# Altium project FMC_SDR_LFFE.PrjPcb (part 2 of 3)

## Sheet LTM8056.SchDoc
size A3; DocumentNumber: 9; SheetNumber: 9; SheetTotal: 10
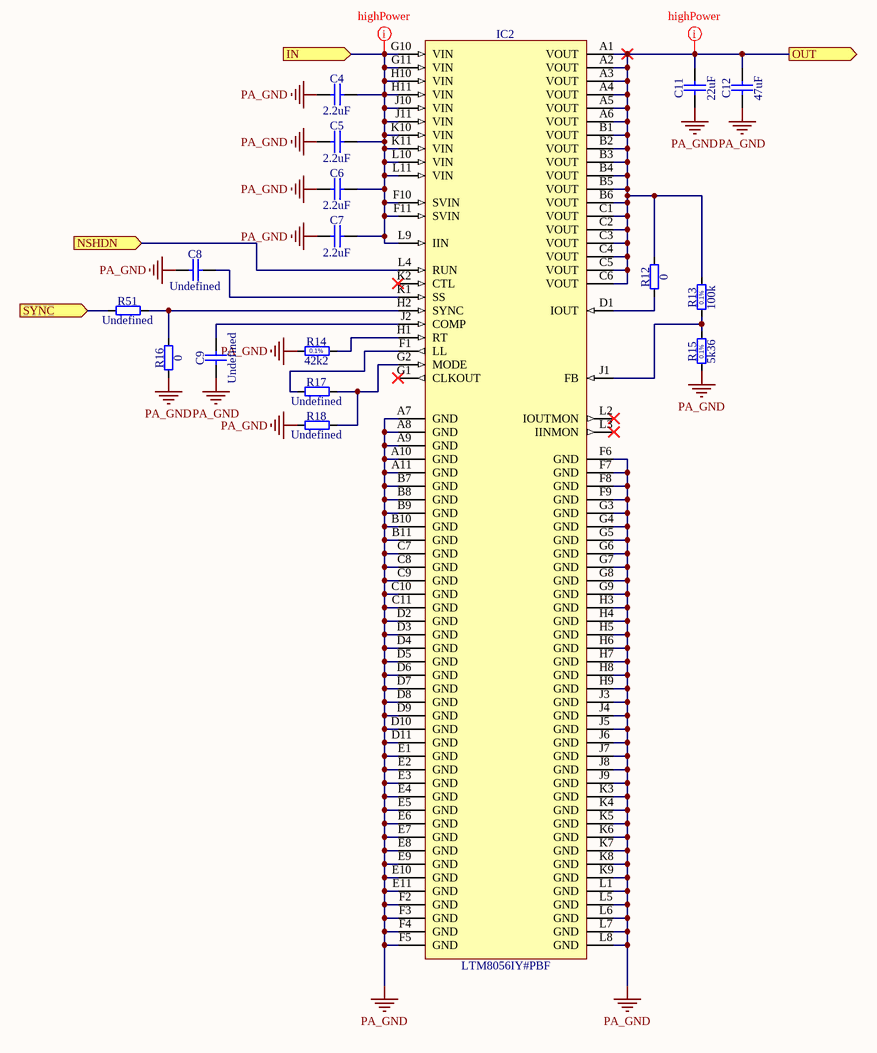
[diagram p4: LTM8056.SchDoc]

### Parts
C4  2.2uF  [CAPC3216X180N]
C5  2.2uF  [CAPC3216X180N]
C6  2.2uF  [CAPC3216X180N]
C7  2.2uF  [CAPC3216X180N]
C8  Undefined  [CAPC1608X90N]
C9  Undefined  [CAPC1608X90N]
C11  22uF  [CAPC_KEMET_KPS2220]
C12  47uF  [CAPC_TDK_CKG57N]
IC2  LTM8056IY#PBF  [BGA121C127P11X11_1500X1500X512]
R12  0  [RESC1608X55N]
R13  100k  [RESC1608X55N]
R14  42k2  [RESC1608X55N]
R15  5k36  [RESC1608X55N]
R16  0  [RESC1608X55N]
R17  Undefined  [RESC1608X55N]
R18  Undefined  [RESC1608X55N]
R51  Undefined  [RESC1608X55N]

### Ports
IN (in), NSHDN (in), OUT (out), SYNC (in)

### Nets
FE_PA_VDD: C11.2 C12.2 IC2.A1(VOUT) IC2.A2(VOUT) IC2.A3(VOUT) IC2.A4(VOUT) IC2.A5(VOUT) IC2.A6(VOUT) IC2.B1(VOUT) IC2.B2(VOUT) IC2.B3(VOUT) IC2.B4(VOUT) IC2.B5(VOUT) IC2.B6(VOUT) IC2.C1(VOUT) IC2.C2(VOUT) IC2.C3(VOUT) IC2.C4(VOUT) IC2.C5(VOUT) IC2.C6(VOUT) R12.2 R13.2 ; port OUT
PA_GND: C4.1 C5.1 C6.1 C7.1 C8.1 C9.1 C11.1 C12.1 IC2.A7(GND) IC2.A8(GND) IC2.A9(GND) IC2.A10(GND) IC2.A11(GND) IC2.B7(GND) IC2.B8(GND) IC2.B9(GND) IC2.B10(GND) IC2.B11(GND) IC2.C7(GND) IC2.C8(GND) IC2.C9(GND) IC2.C10(GND) IC2.C11(GND) IC2.D2(GND) IC2.D3(GND) IC2.D4(GND) IC2.D5(GND) IC2.D6(GND) IC2.D7(GND) IC2.D8(GND) IC2.D9(GND) IC2.D10(GND) IC2.D11(GND) IC2.E1(GND) IC2.E2(GND) IC2.E3(GND) IC2.E4(GND) IC2.E5(GND) IC2.E6(GND) IC2.E7(GND) IC2.E8(GND) IC2.E9(GND) IC2.E10(GND) IC2.E11(GND) IC2.F2(GND) IC2.F3(GND) IC2.F4(GND) IC2.F5(GND) IC2.F6(GND) IC2.F7(GND) IC2.F8(GND) IC2.F9(GND) IC2.G3(GND) IC2.G4(GND) IC2.G5(GND) IC2.G6(GND) IC2.G7(GND) IC2.G8(GND) IC2.G9(GND) IC2.H3(GND) IC2.H4(GND) IC2.H5(GND) IC2.H6(GND) IC2.H7(GND) IC2.H8(GND) IC2.H9(GND) IC2.J3(GND) IC2.J4(GND) IC2.J5(GND) IC2.J6(GND) IC2.J7(GND) IC2.J8(GND) IC2.J9(GND) IC2.K3(GND) IC2.K4(GND) IC2.K5(GND) IC2.K6(GND) IC2.K7(GND) IC2.K8(GND) IC2.K9(GND) IC2.L1(GND) IC2.L5(GND) IC2.L6(GND) IC2.L7(GND) IC2.L8(GND) R14.1 R15.1 R16.1 R18.1
PA_PS_IN: C4.2 C5.2 C6.2 C7.2 IC2.F10(SVIN) IC2.F11(SVIN) IC2.G10(VIN) IC2.G11(VIN) IC2.H10(VIN) IC2.H11(VIN) IC2.J10(VIN) IC2.J11(VIN) IC2.K10(VIN) IC2.K11(VIN) IC2.L9(IIN) IC2.L10(VIN) IC2.L11(VIN) ; port IN
SYNC_DCDC: R51.1 ; port SYNC
NetC8_2: C8.2 IC2.K1(SS)
NetC9_2: C9.2 IC2.J2(COMP)
NetIC2_D1: IC2.D1(IOUT) R12.1
NetIC2_F1: IC2.F1(LL) R17.1
NetIC2_G2: IC2.G2(MODE) R17.2 R18.2
NetIC2_H1: IC2.H1(RT) R14.2
NetIC2_H2: IC2.H2(SYNC) R16.2 R51.2
NetIC2_J1: IC2.J1(FB) R13.1 R15.2
NetIC2_L4: IC2.L4(RUN) ; port NSHDN

Not connected (* = marked no-connect by the designer): IC2 G1(CLKOUT)* K2(CTL)* L2(IOUTMON)* L3(IINMON)*

### Layout directives
net class highPower: FE_PA_VDD, PA_PS_IN

### Notes on the sheet
- (in symbol R0603_5K36_0.1%_0.063W_10PPM) 0.1%
- (in symbol R0603_42K2_0.1%_0.063W_10PPM) 0.1%
- (in symbol R0603_100K_0.1%_0.063W_10PPM) 0.1%

### Library data of the parts
C4-C7 = CC1206_2.2UF_50V_10%_X7R: Non-polarised capacitor; Part Description: SMD Multilayer Chip Ceramic Capacitor; Manufacturer: GENERIC; Manufacturer1 Part Number: C1206C225K5RACTU; Voltage: 50V; TC: X7R; Tolerance: ±10%; Part Number: CC1206_2.2UF_50V_10%_X7R; Component Kind: Standard; Component Type: Standard; Pin Count: 2; Value: 2.2uF; Status: Preferred; Manufacturer Part Number: CC1206_2.2uF_50V_10%_X7R; Case: 1206; Mounted: Yes; Socket: No; SMD: Yes; Sense: No; Manufacturer1 Example: KEMET; Manufacturer1 ComponentHeight: 1.8mm; HelpURL: \\cern.ch\dfs\Applications\Altium\Datasheets\CC1206_X7R_KEMET.pdf; Author: CERN DEM MR; CreateDate: 06.06.2016; LatestRevisionDate: 06.06.2016
C8 C9 = CC0603_NO-VALUE: Non-polarised capacitor; Part Description: Reserved Footprint For 0603(1608) Chip Ceramic Capacitor; Mounted: No; Part Number: CC0603_NO-VALUE; Component Kind: Standard; Component Type: Standard; Pin Count: 2; Value: Undefined; Status: None; Manufacturer: Undefined; Manufacturer Part Number: CC0603_NO-VALUE; Case: 0603; Socket: No; SMD: Yes; Sense: No; Manufacturer1 ComponentHeight: 0.9mm; HelpURL: Undefined; Author: CERN DEM MR; CreateDate: 22.11.2016; LatestRevisionDate: 22.11.2016
C11 = CC2220_22UF_50V_20%_X7R_KEMET_KPS: Non-polarised capacitor; Part Description: Multilayer Ceramic Chip Capacitors - Stacked Cap - KEMET KPS Series; Manufacturer: KEMET; Manufacturer Part Number: C2220C226M5R2C7186; Voltage: 50V; TC: X7R; Tolerance: ±20%; Part Number: CC2220_22UF_50V_20%_X7R_KEMET_KPS; Component Kind: Standard; Component Type: Standard; Pin Count: 2; Value: 22uF; Status: None; Case: 2220; Mounted: Yes; Socket: No; SMD: Yes; Sense: No; ComponentHeight: 5.5mm; HelpURL: \\cern.ch\dfs\Applications\Altium\Datasheets\CC2220_X7R_KEMET_KPS.pdf; Author: CERN DEM JLC; CreateDate: 20.02.2018; LatestRevisionDate: 20.02.2018
C12 = CC2220_47UF_25V_20%_X7S_TDK_CKG57N: Non-polarised capacitor; Part Description: Multilayer Ceramic Chip Capacitor - Stacked Cap, CKG57N Series; Manufacturer: TDK; Manufacturer Part Number: CKG57NX7S1E476M500JH; Voltage: 25V; TC: X7S; Tolerance: ±20%; Part Number: CC2220_47UF_25V_20%_X7S_TDK_CKG57N; Component Kind: Standard; Component Type: Standard; Pin Count: 2; Value: 47uF; Status: None; Case: 2220; Mounted: Yes; Socket: No; SMD: Yes; Sense: No; ComponentHeight: 5.5mm; HelpURL: \\cern.ch\dfs\Applications\Altium\Datasheets\CC2220_X7S_TDK_CKG.pdf; Author: CERN DEM JLC; CreateDate: 21.10.2014; LatestRevisionDate: 18.12.2017
IC2 = LTM8056IY#PBF: 58VIN, 48VOUT Buck-Boost µModule Regulator; Manufacturer: LINEAR TECHNOLOGY; PressFit: No; Bonding: No; Part Number: LTM8056IY#PBF; Component Kind: Standard; Component Type: Standard; Device: LTM8056IY#PBF; PackageDescription: BGA,1.27mm Pitch, Square;121 Pin, 11 Columns X 11 Rows, 15.00mm X 15.00mm X 5.12mm H; Part Description: 58VIN, 48VOUT Buck-Boost µModule Regulator; Manufacturer Part Number: LTM8056IY#PBF; Pin Count: 121; Case: BGA121; Mounted: Yes; Socket: No; SMD: Yes; Sense: No; ComponentHeight: 5.12mm; HelpURL: \\cern.ch\dfs\Applications\Altium\Datasheets\LTM8056IY#PBF.pdf; Author: CERN DEM JLC; CreateDate: 08.04.2019; LatestRevisionDate: 08.04.2019
R12 R16 = R0603_0R_JUMPER: Resistor; Part Description: 1A (0.05R Max DC Resistance) Zero Ohm Jumper; Manufacturer: GENERIC; Manufacturer1 Part Number: NRC06Z0; PressFit: No; Part Number: R0603_0R_JUMPER; Component Kind: Standard; Component Type: Standard; Pin Count: 2; Value: 0; Status: Preferred; Manufacturer Part Number: R0603_0R_JUMPER; Case: 0603; Mounted: Yes; Sense: No; Socket: No; SMD: Yes; Manufacturer1 Example: NIC COMPONENT; Manufacturer1 ComponentHeight: 0.55mm; HelpURL: \\cern.ch\dfs\Applications\Altium\Datasheets\R0603_NIC_NRC.pdf; Author: CERN DEM JLC; CreateDate: 03.12.2007; LatestRevisionDate: 13.03.2008
R13 = R0603_100K_0.1%_0.063W_10PPM: Resistor - 0.1%; Part Description: Thin Film Chip Resistor; Manufacturer: GENERIC; Manufacturer1 Part Number: RN73C1J100KBTDF; Power: 0.063W; TC: ±10ppm; PressFit: No; Part Number: R0603_100K_0.1%_0.063W_10PPM; Component Kind: Standard; Component Type: Standard; Pin Count: 2; Value: 100k; Status: Not Recommended; Tolerance: ±0.1%; Manufacturer Part Number: R0603_100K_0.1%_0.063W_10PPM; Case: 0603; Mounted: Yes; Sense: No; Socket: No; SMD: Yes; Manufacturer1 Example: TYCO HOLSWORTHY; Manufacturer1 ComponentHeight: 0.55mm; HelpURL: \\cern.ch\dfs\Applications\Altium\Datasheets\R0603_Tyco_RN73.pdf; Author: CERN DEM JLC; CreateDate: 03.12.2007; LatestRevisionDate: 13.03.2008
R14 = R0603_42K2_0.1%_0.063W_10PPM: Resistor - 0.1%; Part Description: Thin Film Chip Resistor; Manufacturer: GENERIC; Manufacturer1 Part Number: RN73C1J42K2BTDF; Power: 0.063W; TC: ±10ppm; PressFit: No; Part Number: R0603_42K2_0.1%_0.063W_10PPM; Component Kind: Standard; Component Type: Standard; Pin Count: 2; Value: 42k2; Status: Not Recommended; Tolerance: ±0.1%; Manufacturer Part Number: R0603_42K2_0.1%_0.063W_10PPM; Case: 0603; Mounted: Yes; Sense: No; Socket: No; SMD: Yes; Manufacturer1 Example: TYCO HOLSWORTHY; Manufacturer1 ComponentHeight: 0.5mm; HelpURL: \\cern.ch\dfs\Applications\Altium\Datasheets\R0603_Tyco_RN73.pdf; Author: CERN DEM JLC; CreateDate: 03.12.2007; LatestRevisionDate: 13.03.2008
R15 = R0603_5K36_0.1%_0.063W_10PPM: Resistor - 0.1%; Part Description: Thin Film Chip Resistor; Manufacturer: GENERIC; Manufacturer1 Part Number: RN73C1J5K36BTDF; Power: 0.063W; TC: ±10ppm; PressFit: No; Part Number: R0603_5K36_0.1%_0.063W_10PPM; Component Kind: Standard; Component Type: Standard; Pin Count: 2; Value: 5k36; Status: Not Recommended; Tolerance: ±0.1%; Manufacturer Part Number: R0603_5K36_0.1%_0.063W_10PPM; Case: 0603; Mounted: Yes; Sense: No; Socket: No; SMD: Yes; Manufacturer1 Example: TYCO HOLSWORTHY; Manufacturer1 ComponentHeight: 0.5mm; HelpURL: \\cern.ch\dfs\Applications\Altium\Datasheets\R0603_Tyco_RN73.pdf; Author: CERN DEM JLC; CreateDate: 03.12.2007; LatestRevisionDate: 13.03.2008
R17 R18 R51 = R0603_NO-VALUE: Resistor; Part Description: Reserved Footprint For a 0603 (1608) Chip Resistor; PressFit: No; Mounted: No; Part Number: R0603_NO-VALUE; Component Kind: Standard; Component Type: Standard; Pin Count: 2; Value: Undefined; Status: None; Manufacturer: Undefined; Manufacturer Part Number: R0603_NO-VALUE; Case: 0603; Sense: No; Socket: No; SMD: Yes; Manufacturer1 Example: Undefined; Manufacturer1 Part Number: Undefined; Manufacturer1 ComponentHeight: Undefined; HelpURL: Undefined; Author: CERN DEM JLC; CreateDate: 03.12.2007; LatestRevisionDate: 13.03.2008

## Sheet QPL9065.SchDoc: Title
size 420 x 297 mm; CheckedBy: -; CompanyName: CERN; DrawnBy: DrawnBy; Organization: CERN; Address1: European Organization for Nuclear Research; Address2: CH-1211 Genčve 23 - Switzerland; DocumentNumber: 4; Revision: -; SheetNumber: 4; SheetTotal: 10; EDA_Number: EDA-XXXXX-VX-X; Projet: -; ModifiedBy: -; CreateDate: XX/XX/XXXX; CheckedDate: -; Title2: Title2; DivGrp: TE/MPE; Designer: Designer; ModifiedDate: -
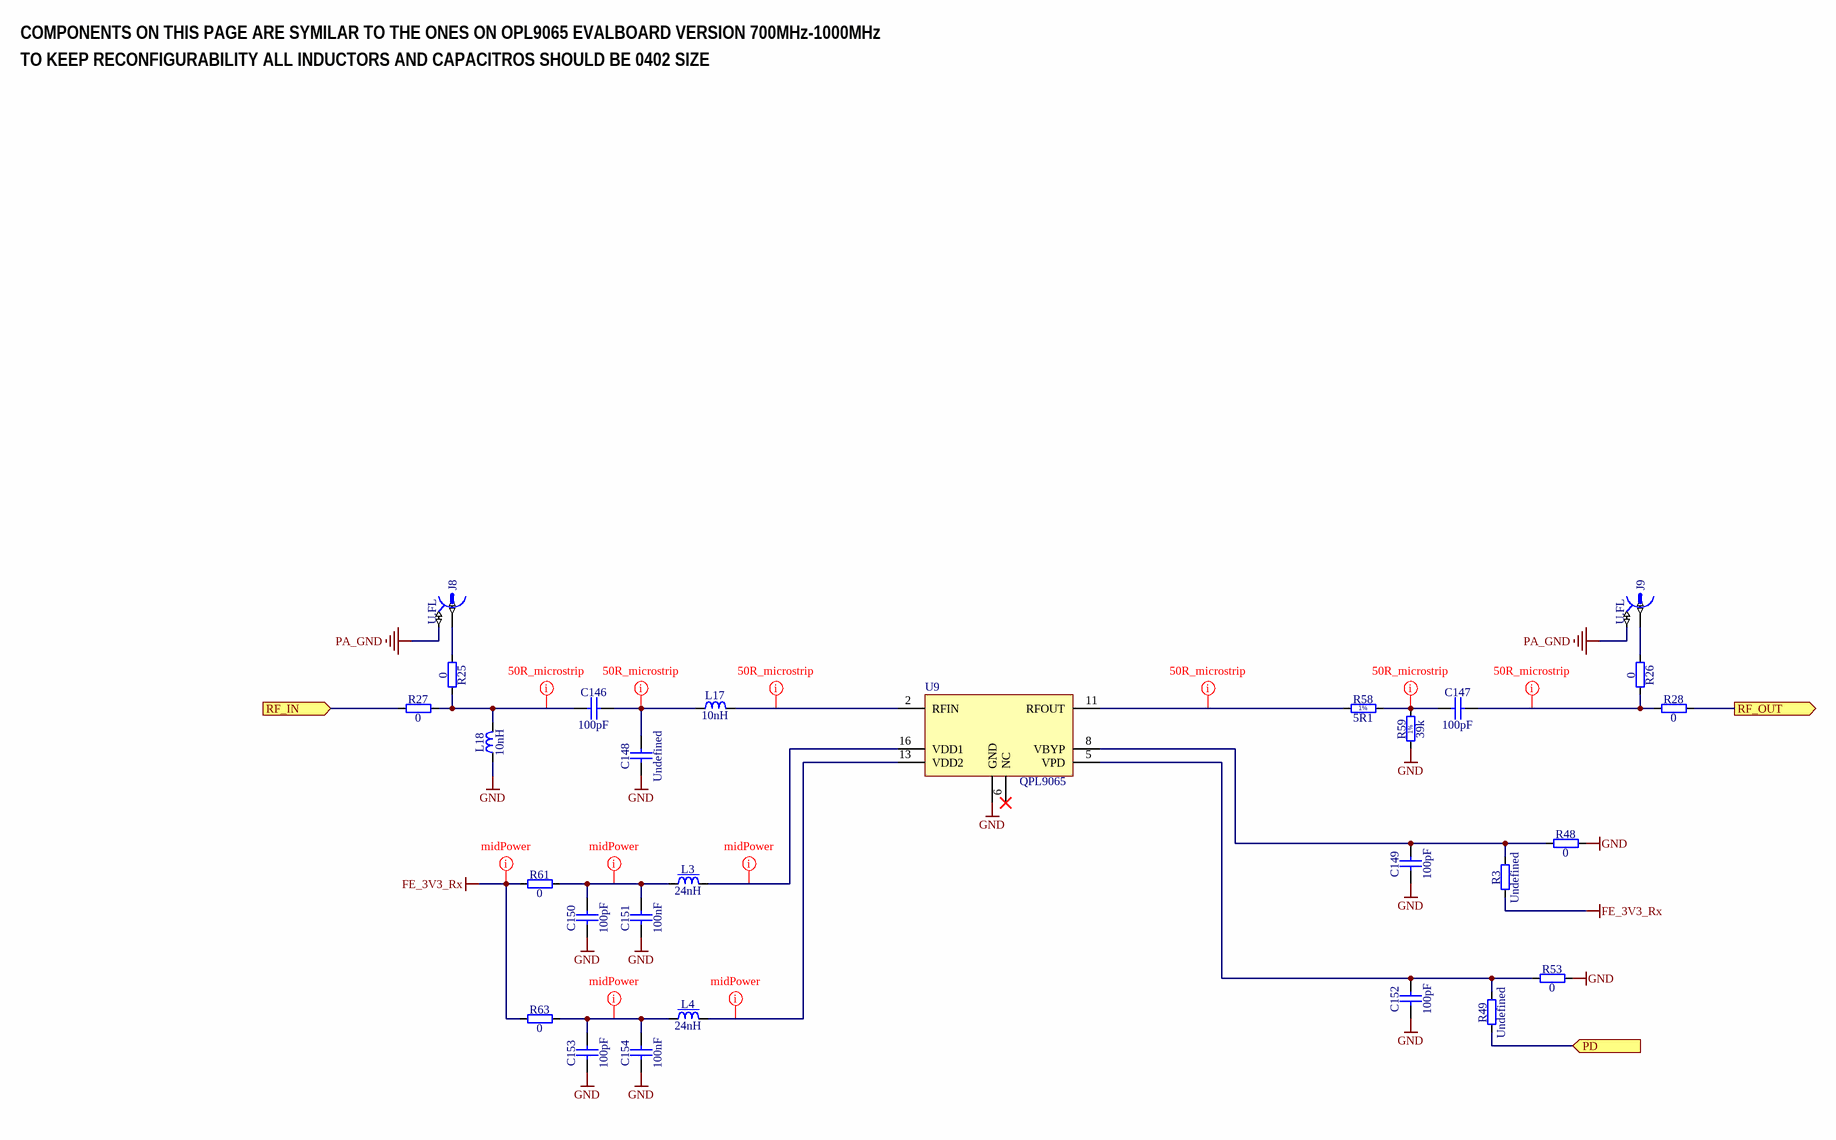
[diagram p5: QPL9065.SchDoc]

### Parts
C146  100pF  [CAPC1005X55N]
C147  100pF  [CAPC1005X55N]
C148  Undefined  [CAPC1005X55N]
C149  100pF  [CAPC1005X55N]
C150  100pF  [CAPC1005X55N]
C151  100nF  [CAPC1005X55N]
C152  100pF  [CAPC1005X55N]
C153  100pF  [CAPC1005X55N]
C154  100nF  [CAPC1005X55N]
J8  U.FL  [HIROSE_U.FL-R-SMT-1(10)]
J9  U.FL  [HIROSE_U.FL-R-SMT-1(10)]
L3  24nH  [IND_COILCRAFT_0805CS]
L4  24nH  [IND_COILCRAFT_0805CS]
L17  10nH  [INDC1005X55N]
L18  10nH  [INDC1005X55N]
R3  Undefined  [RESC1005X40N]
R25  0  [RESC1005X40N]
R26  0  [RESC1005X40N]
R27  0  [RESC1005X40N]
R28  0  [RESC1005X40N]
R48  0  [RESC1005X40N]
R49  Undefined  [RESC1005X40N]
R53  0  [RESC1005X40N]
R58  5R1  [RESC1005X40N]
R59  39k  [RESC1005X40N]
R61  0  [RESC1608X55N]
R63  0  [RESC1608X55N]
U9  QPL9065  [QPL9065]

### Ports
PD (in), RF_IN (in), RF_OUT (out)

### Nets
FE_3V3_Rx: R3.1 R61.1 R63.1
GND: C148.1 C149.1 C150.1 C151.1 C152.1 C153.1 C154.1 L18.1 R48.2 R53.2 R59.1 U9.1,3,4,7,9,10,12,14,15(GND)
PA_GND: J8.2 J9.2
LNA_PD: R49.1 ; port PD
NetC146_1: C146.1 L18.2 R25.2 R27.2
NetC146_2: C146.2 C148.2 L17.1
NetC147_1: C147.1 R58.2 R59.2
NetC147_2: C147.2 R26.2 R28.1
NetC149_2: C149.2 R3.2 R48.1 U9.8(VBYP)
NetC150_2: C150.2 C151.2 L3.1 R61.2
NetC152_2: C152.2 R49.2 R53.1 U9.5(VPD)
NetC153_2: C153.2 C154.2 L4.1 R63.2
NetFL4_1: R28.2 ; port RF_OUT
NetIC9_4: R27.1 ; port RF_IN
NetJ8_1: J8.1 R25.1
NetJ9_1: J9.1 R26.1
NetL3_2: L3.2 U9.16(VDD1)
NetL4_2: L4.2 U9.13(VDD2)
NetL17_2: L17.2 U9.2(RFIN)
NetR58_1: R58.1 U9.11(RFOUT)

Not connected (* = marked no-connect by the designer): U9 6(NC)*

### Layout directives
net class midPower: FE_3V3_Rx, NetC150_2, NetC153_2, NetL3_2, NetL4_2
net class 50R_class: NetC146_1, NetC146_2, NetC147_1, NetC147_2, NetL17_2, NetR58_1

### Notes on the sheet
- COMPONENTS ON THIS PAGE ARE SYMILAR TO THE ONES ON OPL9065 EVALBOARD VERSION 700MHz-1000MHz
- TO KEEP RECONFIGURABILITY ALL INDUCTORS AND CAPACITROS SHOULD BE 0402 SIZE
- Project/Equipment
- Document
- Designer
- Drawn by
- Check.by
- File
- Last Mod.
- Print Date
- Sheet
- Size
- A3
- of
- Rev
- (in symbol R0402_5R1_1%_0.0625W_100PPM) 1%
- (in symbol R0402_39K_1%_0.0625W_100PPM) 1%

### Library data of the parts
C146 C147 C149 C150 C152 C153 = CC0402_100PF_50V_5%_C0G: Non-polarised capacitor; Part Description: SMD Multilayer Chip Ceramic Capacitor; Manufacturer: GENERIC; Manufacturer1 Part Number: C0402C101J5GACTU; Voltage: 50V; TC: C0G/NP0; Tolerance: ±5%; Part Number: CC0402_100PF_50V_5%_C0G; Component Kind: Standard; Component Type: Standard; Pin Count: 2; Value: 100pF; Status: Preferred; Manufacturer Part Number: CC0402_100PF_50V_5%_C0G; Case: 0402; Mounted: Yes; Socket: No; SMD: Yes; Sense: No; Manufacturer1 Example: KEMET; Manufacturer1 ComponentHeight: 0.55mm; HelpURL: \\cern.ch\dfs\Applications\Altium\Datasheets\CC0805_C0G_KEMET_(Commercial Grade).pdf; Author: CERN DEM JLC; CreateDate: 03.12.2007; LatestRevisionDate: 22.04.2015
C148 = CC0402_NO-VALUE: Non-polarised capacitor; Part Description: Reserved Footprint For 0402(1005) Chip Ceramic Capacitor; Mounted: No; Part Number: CC0402_NO-VALUE; Component Kind: Standard; Component Type: Standard; Pin Count: 2; Value: Undefined; Status: None; Manufacturer: Undefined; Manufacturer Part Number: CC0402_NO-VALUE; Case: 0402; Socket: No; SMD: Yes; Sense: No; Manufacturer1 ComponentHeight: 0.55mm; HelpURL: Undefined; Author: CERN DEM JLC; CreateDate: 14.01.2014; LatestRevisionDate: 14.01.2014
C151 C154 = CC0402_100NF_50V_10%_X7R: Non-polarised capacitor; Part Description: SMD Multilayer Chip Ceramic Capacitor; Manufacturer: GENERIC; Manufacturer1 Part Number: GRM155R71H104KE14D; Voltage: 50V; TC: X7R; Tolerance: ±10%; Part Number: CC0402_100NF_50V_10%_X7R; Component Kind: Standard; Component Type: Standard; Pin Count: 2; Value: 100nF; Status: None; Manufacturer Part Number: CC0402_100NF_50V_10%_X7R; Case: 0402; Mounted: Yes; Socket: No; SMD: Yes; Sense: No; Manufacturer1 Example: MURATA; Manufacturer1 ComponentHeight: 0.55mm; HelpURL: \\cern.ch\dfs\Applications\Altium\Datasheets\CC0402_MURATA_GRM155R71H104KE14D.pdf; Author: CERN DEM MR; CreateDate: 30.06.2017; LatestRevisionDate: 30.06.2017
J8 J9 = HIROSE_U.FL-R-SMT-1(10): Part Description: Up to 6GHz Ultra Small Surface Mount Male Coaxial Connectors U.FL Series; Manufacturer: HIROSE (HRS); PressFit: No; Part Number: HIROSE_U.FL-R-SMT-1(10); Component Kind: Standard; Component Type: Standard; Pin Count: 2; Family: U.FL; Mounted: Yes; Socket: No; SMD: Yes; Sense: No; Status: None; Manufacturer Part Number: U.FL-R-SMT-1(10); ComponentHeight: 1.25mm; HelpURL: \\cern.ch\dfs\Applications\Altium\Datasheets\HIROSE_U.FL-R-SMT-1(10).pdf; Author: CERN DEM JLC; CreateDate: 24.03.2010; LatestRevisionDate: 24.03.2010
L3 L4 = IND_24NH_2%_COILCRAFT_0805CS: Inductor With Core; Part Description: SMT Chip Inductor; Manufacturer Part Number: 0805CS-240XGLB; Power: 500mA; Resistance: 0.22R; Tolerance: ±2%; Part Number: IND_24NH_2%_COILCRAFT_0805CS; Component Kind: Standard; Component Type: Standard; Pin Count: 2; Value: 24nH; Status: None; Manufacturer: COILCRAFT; Case: 0805; Mounted: Yes; Socket: No; SMD: Yes; Sense: No; ComponentHeight: 1.52mm; HelpURL: \\cern.ch\dfs\Applications\Altium\Datasheets\IND_COILCRAFT_0805CS.pdf; Author: CERN DEM JLC; CreateDate: 19.08.2013; LatestRevisionDate: 19.08.2013
L17 L18 = Inductor_0402_10nH: Inductor; Part Number: IND_10NH; Tolerance: ±1%; Component Kind: Standard; Component Type: Standard; Pin Count: 2; Value: 10nH; Status: None; Mounted: Yes; Socket: No; SMD: Yes; Sense: No
R3 R49 = R0402_NO-VALUE: Resistor; Part Description: Reserved Footprint For a 0402 (1005) Chip Resistor; PressFit: No; Mounted: No; Part Number: R0402_NO-VALUE; Component Kind: Standard; Component Type: Standard; Pin Count: 2; Value: Undefined; Status: None; Manufacturer: Undefined; Manufacturer Part Number: R0402_NO-VALUE; Case: 0402; Sense: No; Socket: No; SMD: Yes; Manufacturer1 Example: Undefined; Manufacturer1 Part Number: Undefined; Manufacturer1 ComponentHeight: Undefined; HelpURL: Undefined; Author: CERN DEM JLC; CreateDate: 03.12.2007; LatestRevisionDate: 13.03.2008
R25-R28 R48 R53 = R0402_0R_JUMPER: Resistor; Part Description: 1A (0.05R Max DC Resistance) Zero Ohm Jumper; Manufacturer: GENERIC; Manufacturer1 Part Number: 232270591001L; PressFit: No; Part Number: R0402_0R_JUMPER; Component Kind: Standard; Component Type: Standard; Pin Count: 2; Value: 0; Status: Not Recommended; Manufacturer Part Number: R0402_0R_JUMPER; Case: 0402; Mounted: Yes; Sense: No; Socket: No; SMD: Yes; Manufacturer1 Example: YAGEO PHYCOMP; Manufacturer1 ComponentHeight: 0.4mm; HelpURL: \\cern.ch\dfs\Applications\Altium\Datasheets\R0402_Phycomp_RC0402.pdf; Author: CERN DEM JLC; CreateDate: 03.12.2007; LatestRevisionDate: 17.10.2012
R58 = R0402_5R1_1%_0.0625W_100PPM: Resistor - 1%; Part Description: General Purpose Thick Film Chip Resistor; Manufacturer: GENERIC; Manufacturer1 Part Number: CRCW04025R10FKED; TC: ±100ppm/°C; PressFit: No; Part Number: R0402_5R1_1%_0.0625W_100PPM; Component Kind: Standard; Component Type: Standard; Pin Count: 2; Value: 5R1; Status: Not Recommended; Power: 0.0625W; Tolerance: ±1%; Manufacturer Part Number: R0402_5R1_1%_0.0625W_100PPM; Case: 0402; Mounted: Yes; Sense: No; Socket: No; SMD: Yes; Manufacturer1 Example: VISHAY; Manufacturer1 ComponentHeight: 0.4mm; HelpURL: \\cern.ch\dfs\Applications\Altium\Datasheets\R0402_VISHAY_CRCW e3.pdf; Author: CERN DEM MR; CreateDate: 22.11.2016; LatestRevisionDate: 22.11.2016
R59 = R0402_39K_1%_0.0625W_100PPM: Resistor - 1%; Part Description: General Purpose Thick Film Chip Resistor; Manufacturer: GENERIC; Manufacturer1 Part Number: 232270673903; TC: ±100ppm/°C; PressFit: No; Part Number: R0402_39K_1%_0.0625W_100PPM; Component Kind: Standard; Component Type: Standard; Pin Count: 2; Value: 39k; Status: Not Recommended; Power: 0.0625W; Tolerance: ±1%; Manufacturer Part Number: R0402_39K_1%_0.0625W_100PPM; Case: 0402; Mounted: Yes; Sense: No; Socket: No; SMD: Yes; Manufacturer1 Example: YAGEO PHYCOMP; Manufacturer1 ComponentHeight: 0.4mm; HelpURL: \\cern.ch\dfs\Applications\Altium\Datasheets\R0402_Phycomp_RC0402.pdf; Author: CERN DEM JLC; CreateDate: 03.12.2007; LatestRevisionDate: 17.10.2012
R61 R63 = R0603_0R_JUMPER: as R12 on sheet LTM8056; Part Number: R0603_0R_JUMPER; Component Kind: Standard; Component Type: Standard; Pin Count: 2; Value: 0; Status: Preferred; Manufacturer Part Number: R0603_0R_JUMPER; Case: 0603; Mounted: Yes; Sense: No; Socket: No; SMD: Yes; Manufacturer1 Example: NIC COMPONENT; Manufacturer1 ComponentHeight: 0.55mm; HelpURL: \\cern.ch\dfs\Applications\Altium\Datasheets\R0603_NIC_NRC.pdf; Author: CERN DEM JLC; CreateDate: 03.12.2007; LatestRevisionDate: 13.03.2008

## Sheet TGA2237orHMC453.SchDoc: Title
size 420 x 297 mm; CheckedBy: -; CompanyName: CERN; DrawnBy: DrawnBy; Organization: CERN; Address1: European Organization for Nuclear Research; Address2: CH-1211 Genčve 23 - Switzerland; DocumentNumber: 6; Revision: -; SheetNumber: 6; SheetTotal: 10; EDA_Number: EDA-XXXXX-VX-X; Projet: -; ModifiedBy: -; CreateDate: XX/XX/XXXX; CheckedDate: -; Title2: Title2; DivGrp: TE/MPE; Designer: Designer; ModifiedDate: -
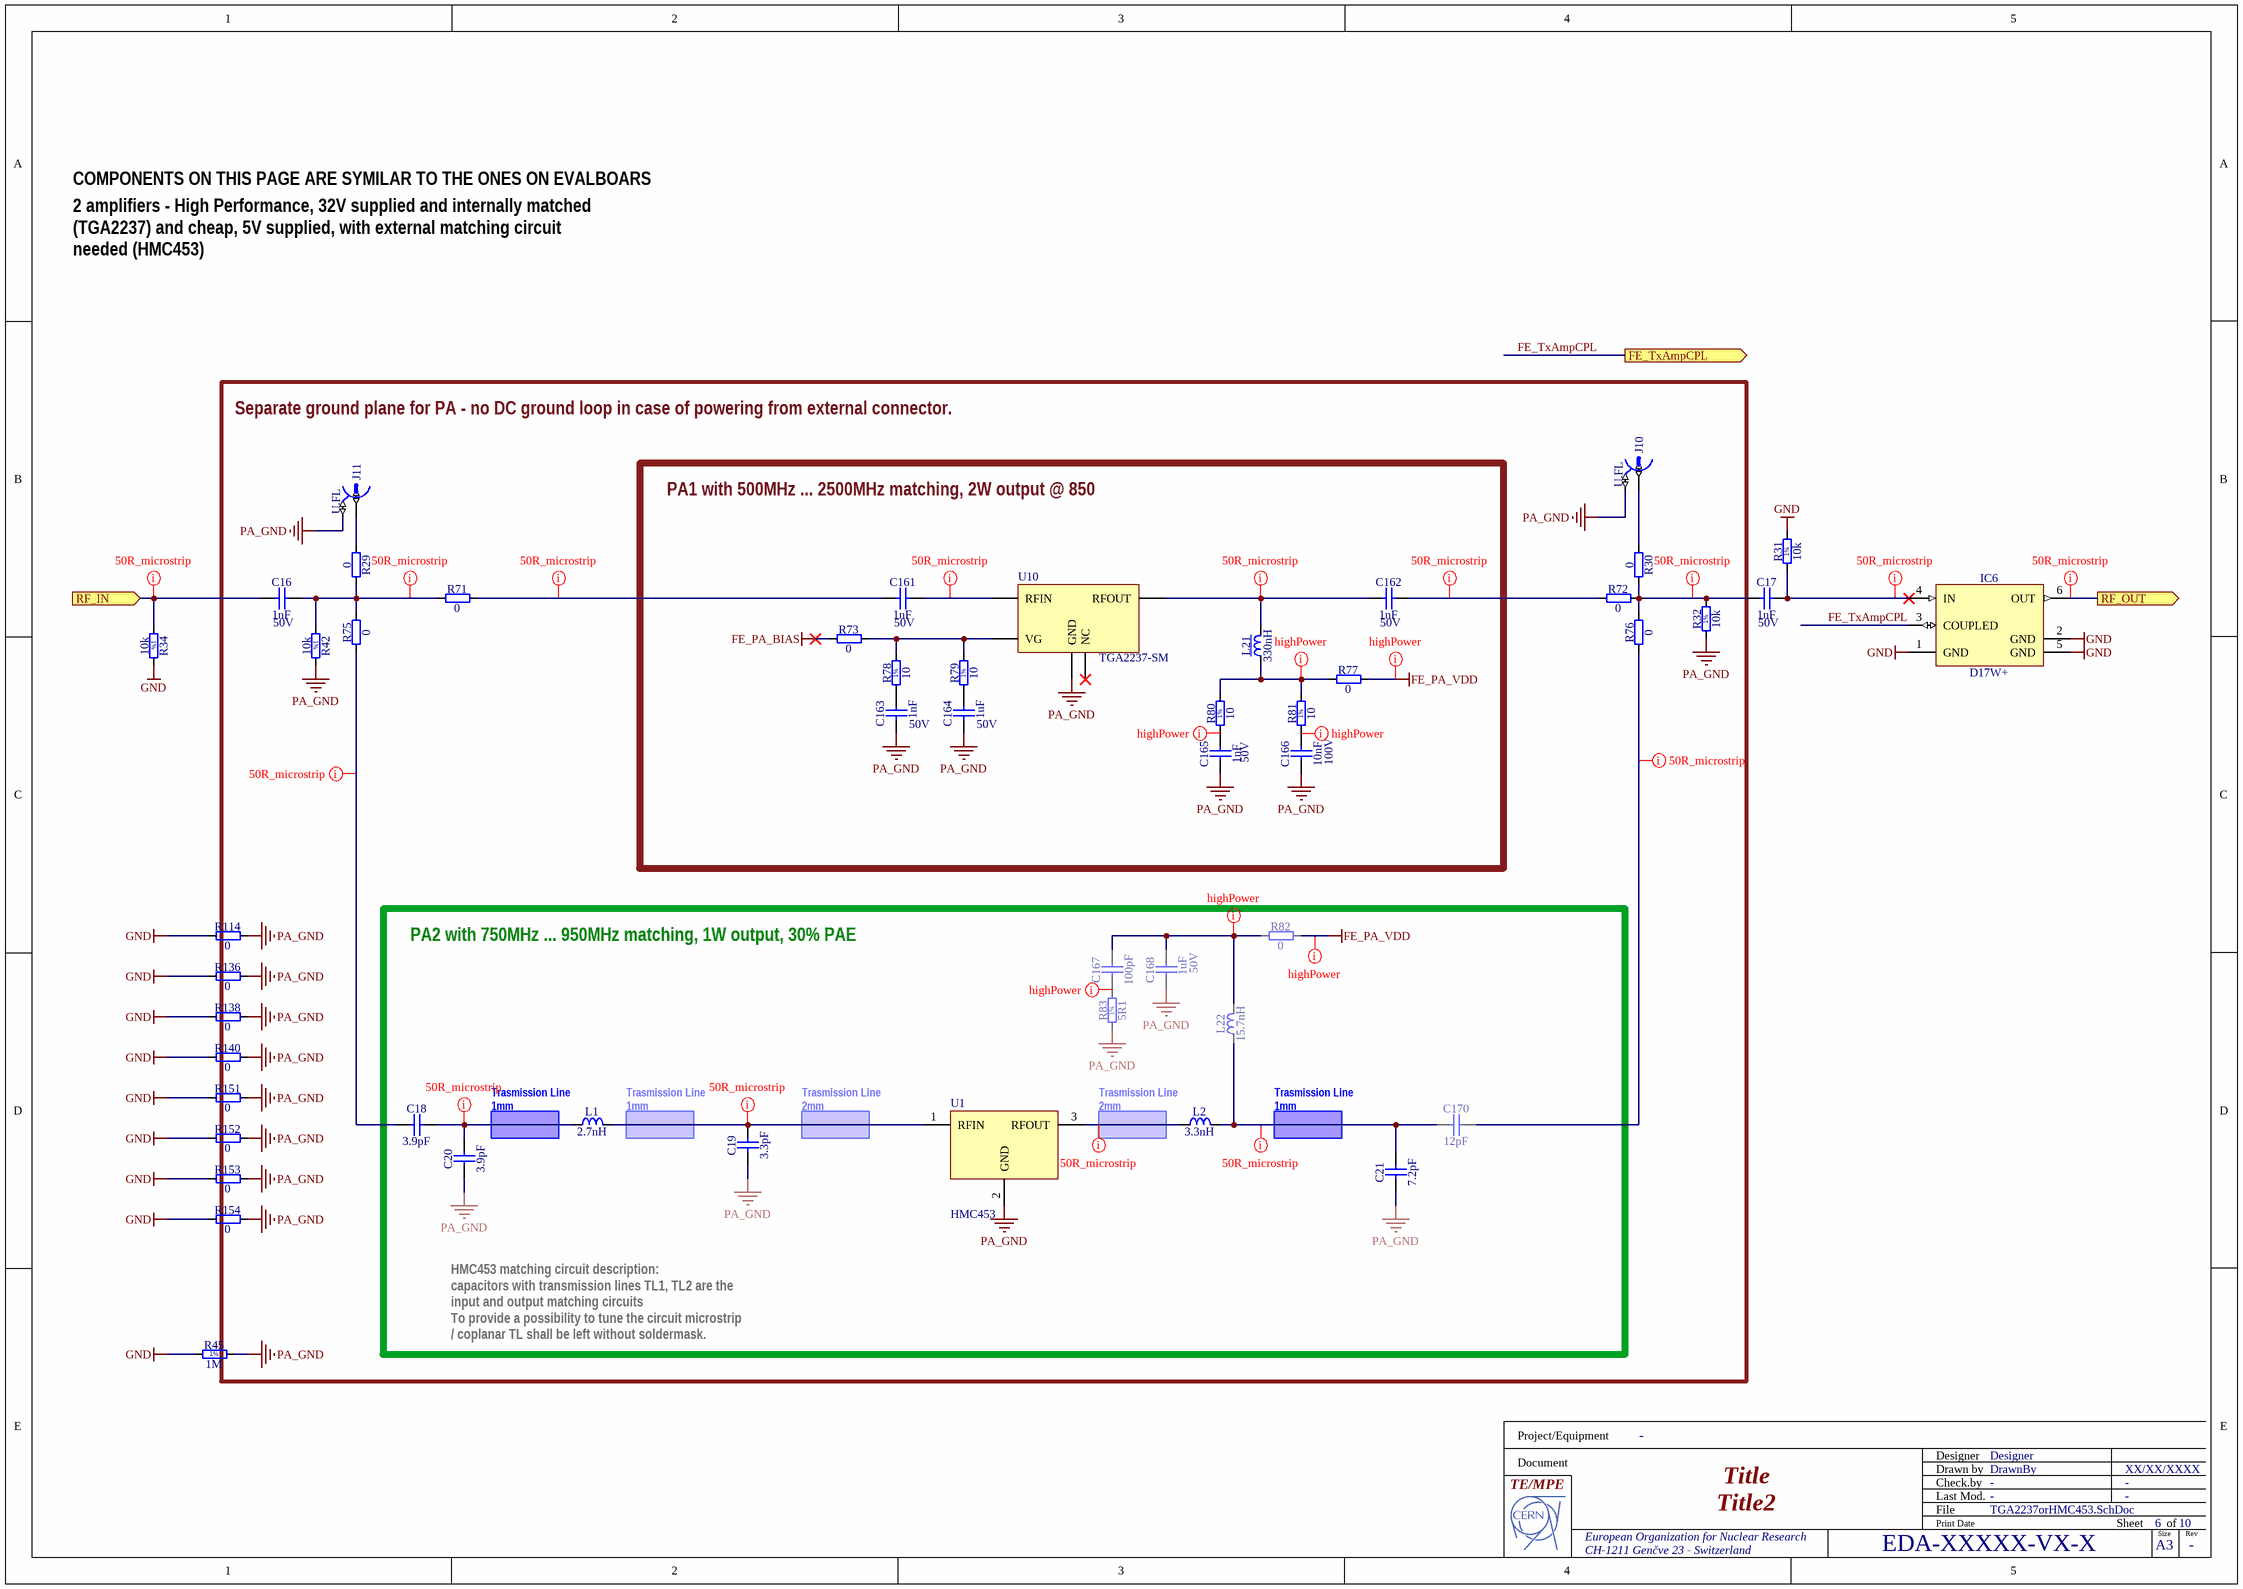
[diagram p6: TGA2237orHMC453.SchDoc]

### Parts
C16  1nF  Voltage: 50V  [CAPC1005X55N]
C17  1nF  Voltage: 50V  [CAPC1005X55N]
C18  3.9pF  [CAPC1005X55N]
C19  3.3pF  [CAPC1005X55N]
C20  3.9pF  [CAPC1005X55N]
C21  7.2pF  [CAPC1005X55N]
C161  1nF  Voltage: 50V  [CAPC1005X55N]
C162  1nF  Voltage: 50V  [CAPC1005X55N]
C163  1nF  Voltage: 50V  [CAPC1005X55N]
C164  1uF  Voltage: 50V  [CAPC2012X110N]
C165  1nF  Voltage: 50V  [CAPC1005X55N]
C166  10nF  Voltage: 100V  [CAPC1608X90N]
C167  100pF  [CAPC1005X55N]
C168  1uF  Voltage: 50V  [CAPC2012X110N]
C170  12pF  [CAPC1005X61N]
IC6  D17W+  [MINI-CIRCUITS_CA531]
J10  U.FL  [HIROSE_U.FL-R-SMT-1(10)]
J11  U.FL  [HIROSE_U.FL-R-SMT-1(10)]
L1  2.7nH  [INDC1005X55N]
L2  3.3nH  [INDC1005X55N]
L21  330nH  [IND_COILCRAFT_0805CS]
L22  15.7nH  [IND_COILCRAFT_0806SQ-16N]
R29  0  [RESC1005X40N]
R30  0  [RESC1005X40N]
R31  10k  [RESC1005X40N]
R32  10k  [RESC1005X40N]
R34  10k  [RESC1005X40N]
R42  10k  [RESC1005X40N]
R45  1M  [RESC1005X40N]
R71  0  [RESC1005X40N]
R72  0  [RESC1005X40N]
R73  0  [RESC1608X55N]
R75  0  [RESC1005X40N]
R76  0  [RESC1005X40N]
R77  0  [RESC1608X55N]
R78  10  [RESC1005X40N]
R79  10  [RESC1005X40N]
R80  10  [RESC1005X40N]
R81  10  [RESC1005X40N]
R82  0  [RESC1608X55N]
R83  5R1  [RESC1005X40N]
R114  0  [RESC1608X55N]
R136  0  [RESC1608X55N]
R138  0  [RESC1608X55N]
R140  0  [RESC1608X55N]
R151  0  [RESC1608X55N]
R152  0  [RESC1608X55N]
R153  0  [RESC1608X55N]
R154  0  [RESC1608X55N]
U1  HMC453  [HMC453]
U10  TGA2237-SM  [TGA2237-SM]

### Ports
FE_TxAmpCPL (out), RF_IN (in), RF_OUT (out)

### Nets
FE_PA_BIAS: R73.1
FE_PA_VDD: R77.2 R82.2
GND: IC6.1(GND) IC6.2(GND) IC6.5(GND) R31.2 R34.2 R45.1 R114.1 R136.1 R138.1 R140.1 R151.1 R152.1 R153.1 R154.1
PA_GND: C19.1 C20.1 C21.1 C163.1 C164.1 C165.1 C166.1 C168.1 J10.2 J11.2 R32.1 R42.2 R45.2 R83.1 R114.2 R136.2 R138.2 R140.2 R151.2 R152.2 R153.2 R154.2 U1.2(GND) U10.1,2,4,6,8,9,16,17,19,21,23,24,25,32(GND)
FE_TxAmpCPL: IC6.3(COUPLED) ; port FE_TxAmpCPL
NetC16_1: C16.1 R34.1 ; port RF_IN
NetC16_2: C16.2 R29.2 R42.1 R71.1 R75.2
NetC17_1: C17.1 R30.2 R32.2 R72.2 R76.2
NetC17_2: C17.2 IC6.4(IN) R31.1
NetC18_1: C18.1 R75.1
NetC18_2: C18.2 C20.2 L1.1
NetC19_2: C19.2 L1.2 U1.1(RFIN)
NetC21_2: C21.2 C170.1 L2.2 L22.1
NetC161_1: C161.1 R71.2
NetC161_2: C161.2 U10.5(RFIN)
NetC162_1: C162.1 L21.2 U10.20(RFOUT)
NetC162_2: C162.2 R72.1
NetC163_2: C163.2 R78.1
NetC164_2: C164.2 R79.1
NetC165_2: C165.2 R80.1
NetC166_2: C166.2 R81.1
NetC167_1: C167.1 R83.2
NetC167_2: C167.2 C168.2 L22.2 R82.1
NetC170_2: C170.2 R76.1
NetFL1_1: IC6.6(OUT) ; port RF_OUT
NetJ10_1: J10.1 R30.1
NetJ11_1: J11.1 R29.1
NetL2_1: L2.1 U1.3(RFOUT)
NetL21_1: L21.1 R77.1 R80.2 R81.2
NetR73_2: R73.2 R78.2 R79.2 U10.26(VG)

Not connected (* = marked no-connect by the designer): U10 3,7,10,11,12,13,14,15,18,22,27,28,29,30,31(NC)*

### Layout directives
net class 50R_class: NetC16_1, NetC16_2, NetC17_1, NetC17_2, NetC18_1, NetC18_2, NetC19_2, NetC21_2, NetC161_1, NetC161_2, NetC162_1, NetC162_2, NetC170_2, NetFL1_1, NetL2_1
net class highPower: FE_PA_VDD, NetC165_2, NetC166_2, NetC167_1, NetC167_2, NetL21_1

### Notes on the sheet
- COMPONENTS ON THIS PAGE ARE SYMILAR TO THE ONES ON EVALBOARS
- 2 amplifiers - High Performance, 32V supplied and internally matched (TGA2237) and cheap, 5V supplied, with external matching circuit needed (HMC453)
- Separate ground plane for PA - no DC ground loop in case of powering from external connector.
- PA1 with 500MHz ... 2500MHz matching, 2W output @ 850 ... 2250MHz, 27% PAE @850MHz, 20% PAE @2200MHz
- PA2 with 750MHz ... 950MHz matching, 1W output, 30% PAE
- (near L1) Trasmission Line
  1mm
- Trasmission Line
  1mm
- (near U1) Trasmission Line
  2mm
- (near L2) Trasmission Line
  2mm
- HMC453 matching circuit description:
  capacitors with transmission lines TL1, TL2 are the input and output matching circuits
  To provide a possibility to tune the circuit microstrip / coplanar TL shall be left without soldermask.
- Project/Equipment
- Document
- Designer
- Drawn by
- Check.by
- File
- Last Mod.
- Print Date
- Sheet
- Size
- A3
- of
- Rev
- (in symbol R0402_1M_1%_0.0625W_100PPM) 1%
- (in symbol R0402_5R1_1%_0.0625W_100PPM) 1%
- (in symbol R0402_10K_1%_0.0625W_100PPM) 1%
- (in symbol R0402_10R_1%_0.0625W_200PPM) 1%

### Library data of the parts
C16 C17 C161-C163 C165 = CC0402_1NF_50V_10%_X7R: Non-polarised capacitor; Part Description: SMD Multilayer Chip Ceramic Capacitor; Manufacturer: GENERIC; Manufacturer1 Part Number: 223858715623; TC: X7R; Tolerance: ±10%; Part Number: CC0402_1NF_50V_10%_X7R; Component Kind: Standard; Component Type: Standard; Pin Count: 2; Value: 1nF; Status: Not Recommended; Manufacturer Part Number: CC0402_1NF_50V_10%_X7R; Case: 0402; Mounted: Yes; Socket: No; SMD: Yes; Sense: No; Manufacturer1 Example: PHYCOMP; Manufacturer1 ComponentHeight: 0.55mm; HelpURL: \\cern.ch\dfs\Applications\Altium\Datasheets\CC0402_X7R_PHYCOMP.pdf; Author: CERN DEM JLC; CreateDate: 03.12.2007; LatestRevisionDate: 03.12.2007
C18 = CC0402_3.9pF_50V_10%_NP0: Standard Cap; Part Description: SMD Multilayer Chip Ceramic Capacitor; Manufacturer: Murata; Manufacturer Part Number: GCQ1555C1H3R9WB01D; Voltage: 50V; TC: NP0; Tolerance: ±10%; Part Number: CC0402_3.9pF_50V_10%_NP0; Component Kind: Standard; Component Type: Standard; Pin Count: 2; Value: 3.9pF; Status: Recommended; Case: 0402; Socket: No; SMD: Yes; Sense: No; Author: SHA
C19 = CC0402_3.3PF_50V_0.25PF_C0G: Non-polarised capacitor; Part Description: SMD Multilayer Chip Ceramic Capacitor; Manufacturer: GENERIC; Manufacturer1 Part Number: C0402C339C5GACTU; Voltage: 50V; TC: C0G/NP0; Tolerance: ±0.25pF; Part Number: CC0402_3.3PF_50V_0.25PF_C0G; Component Kind: Standard; Component Type: Standard; Pin Count: 2; Value: 3.3pF; Status: Preferred; Manufacturer Part Number: CC0402_3.3PF_50V_0.25PF_C0G; Case: 0402; Mounted: Yes; Socket: No; SMD: Yes; Sense: No; Manufacturer1 Example: KEMET; Manufacturer1 ComponentHeight: 0.55mm; HelpURL: \\cern.ch\dfs\Applications\Altium\Datasheets\CC0805_C0G_KEMET_(Commercial Grade).pdf; Author: CERN DEM JLC; CreateDate: 03.12.2007; LatestRevisionDate: 22.04.2015
C20 = CC0402_5.6pF_50V_10%_NP0: Standard Cap; Part Number: CC0402_3.9pF_50V_10%_NP0; Part Description: SMD Multilayer Chip Ceramic Capacitor; Manufacturer: Murata; Manufacturer Part Number: GCQ1555C1H3R9WB01D; Voltage: 50V; TC: NP0; Tolerance: ±10%; Component Kind: Standard; Component Type: Standard; Pin Count: 2; Value: 3.9pF; Status: Recommended; Case: 0402; Socket: No; SMD: Yes; Sense: No; Author: SHA
C21 = CC0402_7.2pF_50V_10%_NP0: Standard Cap; Part Description: SMD Multilayer Chip Ceramic Capacitor; Manufacturer: Murata; Manufacturer Part Number: GCQ1555C1H3R9WB01D; Voltage: 50V; TC: NP0; Tolerance: ±10%; Part Number: CC0402_7.2pF_50V_10%_NP0; Component Kind: Standard; Component Type: Standard; Pin Count: 2; Value: 7.2pF; Status: Recommended; Case: 0402; Socket: No; SMD: Yes; Sense: No; Author: SHA
C164 C168 = CC0805_1UF_50V_10%_X7R: Non-polarised capacitor; Part Description: SMD Multilayer Chip Ceramic Capacitor; Manufacturer: GENERIC; Manufacturer1 Part Number: C0805C105K5RACTU; TC: X7R; Tolerance: ±10%; Part Number: CC0805_1UF_50V_10%_X7R; Component Kind: Standard; Component Type: Standard; Pin Count: 2; Value: 1uF; Status: Preferred; Manufacturer Part Number: CC0805_1UF_50V_10%_X7R; Case: 0805; Mounted: Yes; Socket: No; SMD: Yes; Sense: No; Manufacturer1 Example: KEMET; Manufacturer1 ComponentHeight: 1.1mm; HelpURL: \\cern.ch\dfs\Applications\Altium\Datasheets\CC0805_X7R_KEMET.pdf; Author: CERN DEM JLC; CreateDate: 04.12.2013; LatestRevisionDate: 04.12.2013
C166 = CC0603_10NF_100V_10%_X7R_YUDEN_HMK107B7103KAHT: Non-polarised capacitor; Part Description: SMD Multilayer Chip Ceramic Capacitor for Automotive / Industrial Applications; Manufacturer: TAIYO YUDEN; TC: X7R; Tolerance: ±10%; Part Number: CC0603_10NF_100V_10%_X7R_YUDEN_HMK107B7103KAHT; Component Kind: Standard; Component Type: Standard; Pin Count: 2; Value: 10nF; Status: Not Recommended; Manufacturer Part Number: HMK107B7103KAHT; Case: 0603; Mounted: Yes; Socket: No; SMD: Yes; Sense: No; ComponentHeight: 0.9mm; HelpURL: \\cern.ch\dfs\Applications\Altium\Datasheets\CC0603_TAIYO-YUDEN_HMK107B7103KAHT.pdf; Author: CERN DEM JLC; CreateDate: 10.05.2017; LatestRevisionDate: 10.05.2017
C167 = CC0402_100PF_50V_5%_C0G: as C146 on sheet QPL9065; Part Number: CC0402_100PF_50V_5%_C0G; Component Kind: Standard; Component Type: Standard; Pin Count: 2; Value: 100pF; Status: Preferred; Manufacturer Part Number: CC0402_100PF_50V_5%_C0G; Case: 0402; Mounted: Yes; Socket: No; SMD: Yes; Sense: No; Manufacturer1 Example: KEMET; Manufacturer1 ComponentHeight: 0.55mm; HelpURL: \\cern.ch\dfs\Applications\Altium\Datasheets\CC0805_C0G_KEMET_(Commercial Grade).pdf; Author: CERN DEM JLC; CreateDate: 03.12.2007; LatestRevisionDate: 22.04.2015
C170 = CC0402_12PF_50V_1%_NP0_JOHANSON_R07S: Non-polarised capacitor; Part Description: Ultra High-Q SMD Multilayer Capacitor; Manufacturer: JOHANSON TECHNOLOGY; Manufacturer Part Number: 500R07S120FV4T; Voltage: 50V; TC: C0G/NP0; Tolerance: ±1%; Part Number: CC0402_12PF_50V_1%_NP0_JOHANSON_R07S; Component Kind: Standard; Component Type: Standard; Pin Count: 2; Value: 12pF; Status: Not Recommended; Case: 0402; Mounted: Yes; Socket: No; SMD: Yes; Sense: No; ComponentHeight: 0.61mm; HelpURL: \\cern.ch\dfs\Applications\Altium\Datasheets\CC0402_NP0_JOHANSON_R07S.pdf; Author: CERN DEM BC; CreateDate: 20.11.2017; LatestRevisionDate: 26.09.2018
IC6 = D17W+: 50 Ohms, 700 To 3500MHz, 4W, 16-26dB  Directional Coupler; Manufacturer: MINI-CIRCUITS; PressFit: No; Bonding: No; Part Number: D17W+; Component Kind: Standard; Component Type: Standard; Device: D17W+; PackageDescription: MINI-CIRCUITS Case CA531, 0.94mm Pitch, Body 3mm W X 3.1mm L; Part Description: 50 Ohms, 700 To 3500MHz, 4W, 16-26dB  Directional Coupler; Manufacturer Part Number: D17W+; Pin Count: 6; Mounted: Yes; Socket: No; SMD: Yes; Sense: No; ComponentHeight: 1.63mm; Author: CERN DEM MR; HelpURL: \\cern.ch\dfs\Applications\Altium\Datasheets\D17W+.pdf; CreateDate: 05.04.2019; LatestRevisionDate: 05.04.2019
J10 J11 = HIROSE_U.FL-R-SMT-1(10): as J8 on sheet QPL9065; Part Number: HIROSE_U.FL-R-SMT-1(10); Component Kind: Standard; Component Type: Standard; Pin Count: 2; Family: U.FL; Mounted: Yes; Socket: No; SMD: Yes; Sense: No; Status: None; Manufacturer Part Number: U.FL-R-SMT-1(10); ComponentHeight: 1.25mm; HelpURL: \\cern.ch\dfs\Applications\Altium\Datasheets\HIROSE_U.FL-R-SMT-1(10).pdf; Author: CERN DEM JLC; CreateDate: 24.03.2010; LatestRevisionDate: 24.03.2010
L1 = Inductor_0402_2.7nH_murata: RF Inductor; Part Number: LQG15HZ2N7S02D; Manufacturer: Murata; Tolerance: ±1%; Component Kind: Standard; Component Type: Standard; Pin Count: 2; Value: 2.7nH; Status: None; Manufacturer Part Number: LQG15HZ2N7S02D; Mounted: Yes; Socket: No; SMD: Yes; Sense: No
L2 = Inductor_0402_3.3nH_murata: RF Inductor; Part Number: LQG15HZ3N3S02D; Manufacturer: Murata; Manufacturer Part Number: LQG15HZ2N7S02D; Tolerance: ±1%; Component Kind: Standard; Component Type: Standard; Pin Count: 2; Value: 3.3nH; Status: None; Mounted: Yes; Socket: No; SMD: Yes; Sense: No
L21 = IND_330NH_2%_COILCRAFT_0805CS: Inductor With Core; Part Description: SMT Chip Inductor; Manufacturer Part Number: 0805CS-331XGL; Power: 310mA; Resistance: 1.4R; Tolerance: ±2%; Part Number: IND_330NH_2%_COILCRAFT_0805CS; Component Kind: Standard; Component Type: Standard; Pin Count: 2; Value: 330nH; Status: None; Manufacturer: COILCRAFT; Case: 0805; Mounted: Yes; Socket: No; SMD: Yes; Sense: No; ComponentHeight: 1.52mm; HelpURL: \\cern.ch\dfs\Applications\Altium\Datasheets\IND_COILCRAFT_0805CS.pdf; Author: CERN DEM JMW; CreateDate: 26.10.2015; LatestRevisionDate: 26.10.2015
L22 = IND_15.7NH_2%_COILCRAFT_0806SQ-16NGLC: Inductor; Part Description: Square Air Core Inductor; Power: 2.9A; Resistance: 0.009R; Tolerance: ±2%; Part Number: IND_15.7NH_2%_COILCRAFT_0806SQ-16NGLC; Component Kind: Standard; Component Type: Standard; Pin Count: 2; Value: 15.7nH; Status: None; Manufacturer: COILCRAFT; Manufacturer Part Number: 0806SQ-16NGLC; Mounted: Yes; Socket: No; SMD: Yes; Sense: No; ComponentHeight: 1.5mm; HelpURL: \\cern.ch\dfs\Applications\Altium\Datasheets\IND_COILCRAFT_0806SQ-16N.pdf; Author: CERN DEM JLC; CreateDate: 21.03.2018; LatestRevisionDate: 21.03.2018
R29 R30 R71 R72 R75 R76 = R0402_0R_JUMPER: as R25 on sheet QPL9065; Part Number: R0402_0R_JUMPER; Component Kind: Standard; Component Type: Standard; Pin Count: 2; Value: 0; Status: Not Recommended; Manufacturer Part Number: R0402_0R_JUMPER; Case: 0402; Mounted: Yes; Sense: No; Socket: No; SMD: Yes; Manufacturer1 Example: YAGEO PHYCOMP; Manufacturer1 ComponentHeight: 0.4mm; HelpURL: \\cern.ch\dfs\Applications\Altium\Datasheets\R0402_Phycomp_RC0402.pdf; Author: CERN DEM JLC; CreateDate: 03.12.2007; LatestRevisionDate: 17.10.2012
R31 R32 R34 R42 = R0402_10K_1%_0.0625W_100PPM: Resistor - 1%; Part Description: General Purpose Thick Film Chip Resistor; Manufacturer: GENERIC; Manufacturer1 Part Number: 232270671003L; TC: ±100ppm/°C; PressFit: No; Part Number: R0402_10K_1%_0.0625W_100PPM; Component Kind: Standard; Component Type: Standard; Pin Count: 2; Value: 10k; Status: Not Recommended; Power: 0.0625W; Tolerance: ±1%; Manufacturer Part Number: R0402_10K_1%_0.0625W_100PPM; Case: 0402; Mounted: Yes; Sense: No; Socket: No; SMD: Yes; Manufacturer1 Example: YAGEO PHYCOMP; Manufacturer1 ComponentHeight: 0.4mm; HelpURL: \\cern.ch\dfs\Applications\Altium\Datasheets\R0402_Phycomp_RC0402.pdf; Author: CERN DEM JLC; CreateDate: 03.12.2007; LatestRevisionDate: 17.10.2012
R45 = R0402_1M_1%_0.0625W_100PPM: Resistor - 1%; Part Description: General Purpose Thick Film Chip Resistor; Manufacturer: GENERIC; Manufacturer1 Part Number: 232270671005L; TC: ±100ppm/°C; PressFit: No; Part Number: R0402_1M_1%_0.0625W_100PPM; Component Kind: Standard; Component Type: Standard; Pin Count: 2; Value: 1M; Status: Not Recommended; Power: 0.0625W; Tolerance: ±1%; Manufacturer Part Number: R0402_1M_1%_0.0625W_100PPM; Case: 0402; Mounted: Yes; Sense: No; Socket: No; SMD: Yes; Manufacturer1 Example: YAGEO PHYCOMP; Manufacturer1 ComponentHeight: 0.4mm; HelpURL: \\cern.ch\dfs\Applications\Altium\Datasheets\R0402_Phycomp_RC0402.pdf; Author: CERN DEM JLC; CreateDate: 03.12.2007; LatestRevisionDate: 17.10.2012
R73 R77 R82 R114 R136 R138 R140 R151-R154 = R0603_0R_JUMPER: as R12 on sheet LTM8056; Part Number: R0603_0R_JUMPER; Component Kind: Standard; Component Type: Standard; Pin Count: 2; Value: 0; Status: Preferred; Manufacturer Part Number: R0603_0R_JUMPER; Case: 0603; Mounted: Yes; Sense: No; Socket: No; SMD: Yes; Manufacturer1 Example: NIC COMPONENT; Manufacturer1 ComponentHeight: 0.55mm; HelpURL: \\cern.ch\dfs\Applications\Altium\Datasheets\R0603_NIC_NRC.pdf; Author: CERN DEM JLC; CreateDate: 03.12.2007; LatestRevisionDate: 13.03.2008
R78-R81 = R0402_10R_1%_0.0625W_200PPM: Resistor - 1%; Part Description: General Purpose Thick Film Chip Resistor; Manufacturer: GENERIC; Manufacturer1 Part Number: 232270671009L; TC: ±200ppm/°C; PressFit: No; Part Number: R0402_10R_1%_0.0625W_200PPM; Component Kind: Standard; Component Type: Standard; Pin Count: 2; Value: 10; Status: Not Recommended; Power: 0.0625W; Tolerance: ±1%; Manufacturer Part Number: R0402_10R_1%_0.0625W_200PPM; Case: 0402; Mounted: Yes; Sense: No; Socket: No; SMD: Yes; Manufacturer1 Example: YAGEO PHYCOMP; Manufacturer1 ComponentHeight: 0.4mm; HelpURL: \\cern.ch\dfs\Applications\Altium\Datasheets\R0402_Phycomp_RC0402.pdf; Author: CERN DEM JLC; CreateDate: 24.06.2009; LatestRevisionDate: 17.10.2012
R83 = R0402_5R1_1%_0.0625W_100PPM: as R58 on sheet QPL9065; Part Number: R0402_5R1_1%_0.0625W_100PPM; Component Kind: Standard; Component Type: Standard; Pin Count: 2; Value: 5R1; Status: Not Recommended; Power: 0.0625W; Tolerance: ±1%; Manufacturer Part Number: R0402_5R1_1%_0.0625W_100PPM; Case: 0402; Mounted: Yes; Sense: No; Socket: No; SMD: Yes; Manufacturer1 Example: VISHAY; Manufacturer1 ComponentHeight: 0.4mm; HelpURL: \\cern.ch\dfs\Applications\Altium\Datasheets\R0402_VISHAY_CRCW e3.pdf; Author: CERN DEM MR; CreateDate: 22.11.2016; LatestRevisionDate: 22.11.2016

## Sheet TXpreamp.SchDoc: Title
size 420 x 297 mm; CheckedBy: -; CompanyName: CERN; DrawnBy: DrawnBy; Organization: CERN; Address1: European Organization for Nuclear Research; Address2: CH-1211 Genčve 23 - Switzerland; DocumentNumber: 7; Revision: -; SheetNumber: 7; SheetTotal: 10; EDA_Number: EDA-XXXXX-VX-X; Projet: -; ModifiedBy: -; CreateDate: XX/XX/XXXX; CheckedDate: -; Title2: Title2; DivGrp: TE/MPE; Designer: Designer; ModifiedDate: -
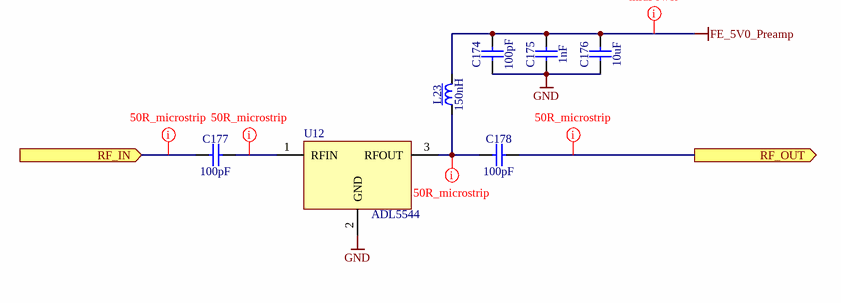
[diagram p7: TXpreamp.SchDoc]

### Parts
C174  100pF  [CAPC1005X55N]
C175  1nF  [CAPC1005X55N]
C176  10uF  [CAPC3216X180N]
C177  100pF  [CAPC1005X55N]
C178  100pF  [CAPC1005X55N]
L23  150nH  [IND_COILCRAFT_0805CS]
U12  ADL5544  [ADL5544]

### Ports
RF_IN (in), RF_OUT (out)

### Nets
FE_5V0_Preamp: C174.2 C175.2 C176.2 L23.2
GND: C174.1 C175.1 C176.1 U12.2(GND)
TX_IN: C177.1 ; port RF_IN
NetC177_2: C177.2 U12.1(RFIN)
NetC178_1: C178.1 L23.1 U12.3(RFOUT)
NetC178_2: C178.2 ; port RF_OUT

### Layout directives
net class midPower: FE_5V0_Preamp
net class 50R_class: NetC177_2, NetC178_2, TX_IN
net class 50R_class; rule Clearance Constraint [Generic clearance = 0.15mm, and 26 value(s) for objects]: NetC178_1

### Notes on the sheet
- Project/Equipment
- Document
- Designer
- Drawn by
- Check.by
- File
- Last Mod.
- Print Date
- Sheet
- Size
- A3
- of
- Rev

### Library data of the parts
C174 C177 C178 = CC0402_100PF_50V_5%_C0G: as C146 on sheet QPL9065; Part Number: CC0402_100PF_50V_5%_C0G; Component Kind: Standard; Component Type: Standard; Pin Count: 2; Value: 100pF; Status: Preferred; Manufacturer Part Number: CC0402_100PF_50V_5%_C0G; Case: 0402; Mounted: Yes; Socket: No; SMD: Yes; Sense: No; Manufacturer1 Example: KEMET; Manufacturer1 ComponentHeight: 0.55mm; HelpURL: \\cern.ch\dfs\Applications\Altium\Datasheets\CC0805_C0G_KEMET_(Commercial Grade).pdf; Author: CERN DEM JLC; CreateDate: 03.12.2007; LatestRevisionDate: 22.04.2015
C175 = CC0402_1NF_50V_10%_X7R: Non-polarised capacitor; Part Description: SMD Multilayer Chip Ceramic Capacitor; Manufacturer: GENERIC; Manufacturer1 Part Number: 223858715623; Voltage: 50V; TC: X7R; Tolerance: ±10%; Part Number: CC0402_1NF_50V_10%_X7R; Component Kind: Standard; Component Type: Standard; Pin Count: 2; Value: 1nF; Status: Not Recommended; Manufacturer Part Number: CC0402_1NF_50V_10%_X7R; Case: 0402; Mounted: Yes; Socket: No; SMD: Yes; Sense: No; Manufacturer1 Example: PHYCOMP; Manufacturer1 ComponentHeight: 0.55mm; HelpURL: \\cern.ch\dfs\Applications\Altium\Datasheets\CC0402_X7R_PHYCOMP.pdf; Author: CERN DEM JLC; CreateDate: 03.12.2007; LatestRevisionDate: 03.12.2007
C176 = CC1206_10UF_25V_10%_X7R: Non-polarised capacitor; Part Description: SMD Multilayer Chip Ceramic Capacitor; Manufacturer: GENERIC; Manufacturer1 Part Number: C1206C106K4RACTU; Voltage: 25V; TC: X7R; Tolerance: ±10%; Part Number: CC1206_10UF_25V_10%_X7R; Component Kind: Standard; Component Type: Standard; Pin Count: 2; Value: 10uF; Status: Preferred; Manufacturer Part Number: CC1206_10uF_25V_10%_X7R; Case: 1206; Mounted: Yes; Socket: No; SMD: Yes; Sense: No; Manufacturer1 Example: KEMET; Manufacturer1 ComponentHeight: 1.8mm; HelpURL: \\cern.ch\dfs\Applications\Altium\Datasheets\CC1206_X7R_KEMET.pdf; Author: CERN DEM JLC; CreateDate: 12.09.2012; LatestRevisionDate: 12.09.2012
L23 = IND_150NH_2%_COILCRAFT_0805CS: Inductor With Core; Part Description: SMT Chip Inductor; Manufacturer Part Number: 0805CS-151XGLC; Power: 400mA; Resistance: 0.56R; Tolerance: ±2%; Part Number: IND_150NH_2%_COILCRAFT_0805CS; Component Kind: Standard; Component Type: Standard; Pin Count: 2; Value: 150nH; Status: None; Manufacturer: COILCRAFT; Case: 0805; Mounted: Yes; Socket: No; SMD: Yes; Sense: No; ComponentHeight: 1.52mm; HelpURL: \\cern.ch\dfs\Applications\Altium\Datasheets\IND_COILCRAFT_0805CS.pdf; Author: CERN DEM JLC; CreateDate: 03.03.2015; LatestRevisionDate: 03.03.2015

## Sheet TDDswitches.SchDoc: Title
size 420 x 297 mm; CheckedBy: -; CompanyName: CERN; DrawnBy: DrawnBy; Organization: CERN; Address1: European Organization for Nuclear Research; Address2: CH-1211 Genčve 23 - Switzerland; DocumentNumber: 5; Revision: -; SheetNumber: 5; SheetTotal: 10; EDA_Number: EDA-XXXXX-VX-X; Projet: -; ModifiedBy: -; CreateDate: XX/XX/XXXX; CheckedDate: -; Title2: Title2; DivGrp: TE/MPE; Designer: Designer; ModifiedDate: -
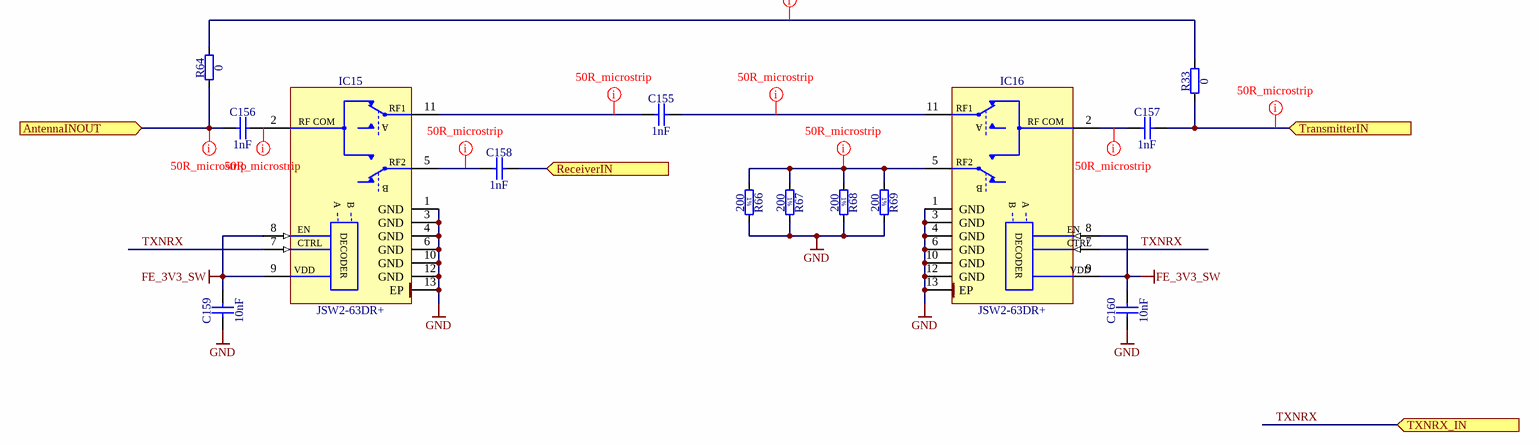
[diagram p8: TDDswitches.SchDoc]

### Parts
C155  1nF  [CAPC1005X55N]
C156  1nF  [CAPC1005X55N]
C157  1nF  [CAPC1005X55N]
C158  1nF  [CAPC1005X55N]
C159  10nF  [CAPC1005X55N]
C160  10nF  [CAPC1005X55N]
IC15  JSW2-63DR+  [MINI-CIRCUITS_MT1818]
IC16  JSW2-63DR+  [MINI-CIRCUITS_MT1818]
R33  0  [RESC1005X40N]
R64  0  [RESC1005X40N]
R66  200  [RESC3216X65N]
R67  200  [RESC3216X65N]
R68  200  [RESC3216X65N]
R69  200  [RESC3216X65N]

### Ports
AntennaINOUT (in), ReceiverIN (in), TransmitterIN (in), TXNRX_IN (in)

### Nets
FE_3V3_SW: C159.2 C160.2 IC15.8(EN) IC15.9(VDD) IC16.8(EN) IC16.9(VDD)
GND: C159.1 C160.1 IC15.1(GND) IC15.3(GND) IC15.4(GND) IC15.6(GND) IC15.10(GND) IC15.12(GND) IC15.13(EP) IC16.1(GND) IC16.3(GND) IC16.4(GND) IC16.6(GND) IC16.10(GND) IC16.12(GND) IC16.13(EP) R66.2 R67.2 R68.2 R69.2
TXNRX: IC15.7(CTRL) IC16.7(CTRL) ; port TXNRX_IN
NetC155_1: C155.1 IC15.11(RF1)
NetC155_2: C155.2 IC16.11(RF1)
NetC156_1: C156.1 R64.1 ; port AntennaINOUT
NetC156_2: C156.2 IC15.2(RF_COM)
NetC157_1: C157.1 IC16.2(RF_COM)
NetC157_2: C157.2 R33.1 ; port TransmitterIN
NetC158_1: C158.1 IC15.5(RF2)
NetC158_2: C158.2 ; port ReceiverIN
NetIC16_5: IC16.5(RF2) R66.1 R67.1 R68.1 R69.1
NetR33_2: R33.2 R64.2

### Layout directives
net class 50R_class: NetC155_1, NetC155_2, NetC156_1, NetC156_2, NetC157_1, NetC157_2, NetC158_1, NetIC16_5, NetR33_2

### Notes on the sheet
- Project/Equipment
- Document
- Designer
- Drawn by
- Check.by
- File
- Last Mod.
- Print Date
- Sheet
- Size
- A3
- of
- Rev
- (in symbol JSW2-63DR+) A; B; DECODER
- (in symbol R1206_200R_1%_0.25W_100PPM) 1%

### Library data of the parts
C155-C158 = CC0402_1NF_50V_10%_X7R: as C175 on sheet TXpreamp; Part Number: CC0402_1NF_50V_10%_X7R; Component Kind: Standard; Component Type: Standard; Pin Count: 2; Value: 1nF; Status: Not Recommended; Manufacturer Part Number: CC0402_1NF_50V_10%_X7R; Case: 0402; Mounted: Yes; Socket: No; SMD: Yes; Sense: No; Manufacturer1 Example: PHYCOMP; Manufacturer1 ComponentHeight: 0.55mm; HelpURL: \\cern.ch\dfs\Applications\Altium\Datasheets\CC0402_X7R_PHYCOMP.pdf; Author: CERN DEM JLC; CreateDate: 03.12.2007; LatestRevisionDate: 03.12.2007
C159 C160 = CC0402_10NF_50V_10%_X7R: Non-polarised capacitor; Part Description: SMD Multilayer Chip Ceramic Capacitor; Manufacturer: GENERIC; Manufacturer1 Part Number: GRM155R71H103KA88D; Voltage: 50V; TC: X7R; Tolerance: ±10%; Part Number: CC0402_10NF_50V_10%_X7R; Component Kind: Standard; Component Type: Standard; Pin Count: 2; Value: 10nF; Status: None; Manufacturer Part Number: CC0402_10NF_50V_10%_X7R; Case: 0402; Mounted: Yes; Socket: No; SMD: Yes; Sense: No; Manufacturer1 Example: MURATA; Manufacturer1 ComponentHeight: 0.55mm; HelpURL: \\cern.ch\dfs\Applications\Altium\Datasheets\CC0402_X7R_MURATA_GRM.pdf; Author: CERN DEM MR; CreateDate: 08.01.2016; LatestRevisionDate: 08.01.2016
IC15 IC16 = JSW2-63DR+: SPDT RF Switch, 50 Ohm, 5 to 6000MHz, High Power 3W; Part Description: SPDT RF Switch, 50 Ohms, 5 to 6000MHz, High Power 3W; Manufacturer: MINI-CIRCUITS; PressFit: No; Bonding: No; Part Number: JSW2-63DR+; Component Kind: Standard; Component Type: Standard; Device: JSW2-63DR+; PackageDescription: MINI-CIRCUITS MT1818 Case, Body 2.06mm L X 2.06mm W X 0.61mm H; Manufacturer Part Number: JSW2-63DR+; Pin Count: 13; Mounted: Yes; Socket: No; SMD: Yes; Sense: No; ComponentHeight: 0.61mm; Author: CERN DEM JMW; HelpURL: \\cern.ch\dfs\Applications\Altium\Datasheets\JSW2-63DR+.pdf; CreateDate: 11.08.2016; LatestRevisionDate: 11.08.2016
R33 R64 = R0402_0R_JUMPER: as R25 on sheet QPL9065; Part Number: R0402_0R_JUMPER; Component Kind: Standard; Component Type: Standard; Pin Count: 2; Value: 0; Status: Not Recommended; Manufacturer Part Number: R0402_0R_JUMPER; Case: 0402; Mounted: Yes; Sense: No; Socket: No; SMD: Yes; Manufacturer1 Example: YAGEO PHYCOMP; Manufacturer1 ComponentHeight: 0.4mm; HelpURL: \\cern.ch\dfs\Applications\Altium\Datasheets\R0402_Phycomp_RC0402.pdf; Author: CERN DEM JLC; CreateDate: 03.12.2007; LatestRevisionDate: 17.10.2012
R66-R69 = R1206_200R_1%_0.25W_100PPM: Resistor - 1%; Part Description: General Purpose Thick Film Chip Resistor; Manufacturer: GENERIC; Manufacturer1 Part Number: NRC12F2000TRF; Power: 0.25W; TC: ±100ppm/°C; PressFit: No; Part Number: R1206_200R_1%_0.25W_100PPM; Component Kind: Standard; Component Type: Standard; Pin Count: 2; Value: 200; Status: Preferred; Tolerance: ±1%; Manufacturer Part Number: R1206_200R_1%_0.25W_100PPM; Case: 1206; Mounted: Yes; Sense: No; Socket: No; SMD: Yes; Manufacturer1 Example: NIC COMPONENT; Manufacturer1 ComponentHeight: 0.65mm; HelpURL: \\cern.ch\dfs\Applications\Altium\Datasheets\R1206_NIC_NRC.pdf; Author: CERN DEM JLC; CreateDate: 03.12.2007; LatestRevisionDate: 13.03.2008